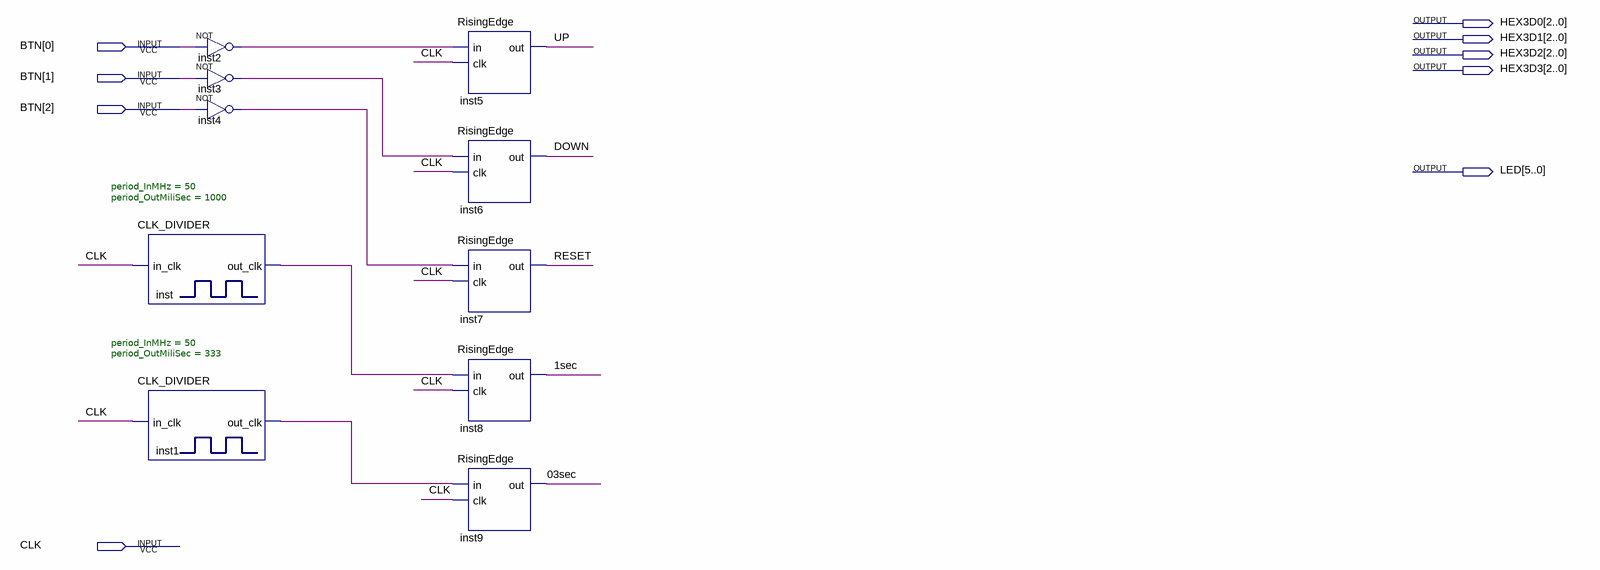
[diagram p0: schematic sheet]
// Quartus schematic main5.bdf as structural Verilog: 10 symbols, 9 pins
module main5 (
  input  [2:0] BTN,
  input  CLK,
  output [2:0] HEX3D0,
  output [2:0] HEX3D1,
  output [2:0] HEX3D2,
  output [2:0] HEX3D3,
  output [5:0] LED
);

  wire \1sec , \03sec , DOWN, inst1_out_clk, inst2_out, inst3_out, inst4_out, inst_out_clk, RESET, UP;

  CLK_DIVIDER #(.period_InMHz(50), .period_OutMiliSec(1000)) inst (.in_clk(CLK), .out_clk(inst_out_clk));
  CLK_DIVIDER #(.period_InMHz(50), .period_OutMiliSec(333)) inst1 (.in_clk(CLK), .out_clk(inst1_out_clk));
  not inst2 (inst2_out, BTN[0]);
  not inst3 (inst3_out, BTN[1]);
  not inst4 (inst4_out, BTN[2]);
  RisingEdge inst5 (.in(inst2_out), .clk(CLK), .out(UP));
  RisingEdge inst6 (.in(inst3_out), .clk(CLK), .out(DOWN));
  RisingEdge inst7 (.in(inst4_out), .clk(CLK), .out(RESET));
  RisingEdge inst8 (.in(inst_out_clk), .clk(CLK), .out(\1sec ));
  RisingEdge inst9 (.in(inst1_out_clk), .clk(CLK), .out(\03sec ));
endmodule
